# Altium schematic sheet P20 Hole.SchDoc
size 297 x 209 mm
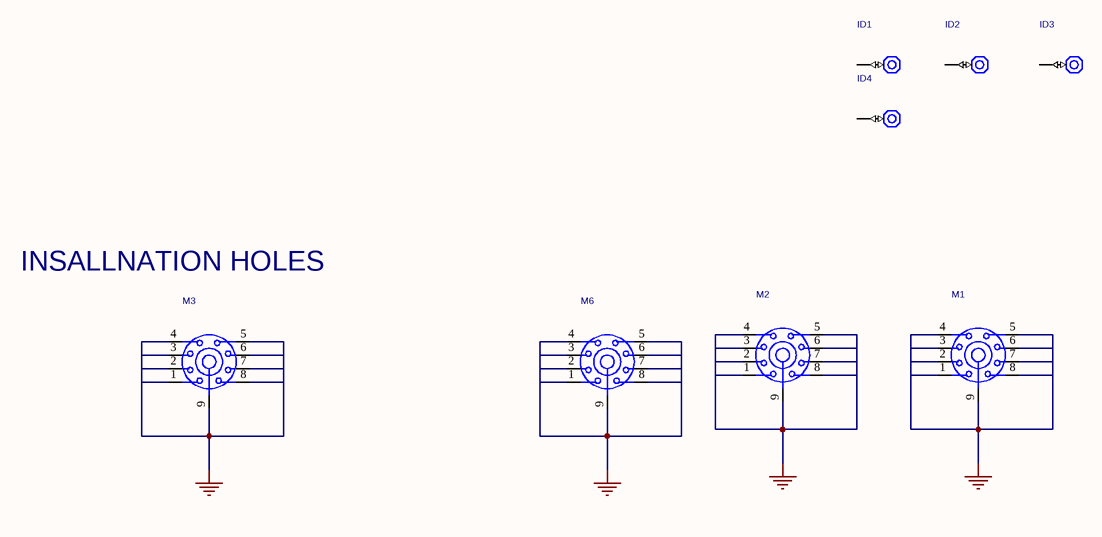
[diagram p0: P20 Hole.SchDoc]

## Parts
ID1  ID-BOARD  [ID-BOARD]  (value not drawn)
ID2  ID-BOARD  [ID-BOARD]  (value not drawn)
ID3  ID-BOARD  [ID-BOARD]  (value not drawn)
ID4  ID-BOARD  [ID-BOARD]  (value not drawn)
M1  HOLE-8STARS  [MTH_C6MMD3P2MM]  (value not drawn)
M2  HOLE-8STARS  [MTH_C6MMD3P2MM]  (value not drawn)
M3  HOLE-8STARS  [MTH_C6MMD3P2MM]  (value not drawn)
M6  HOLE-8STARS  [MTH_C6MMD3P2MM]  (value not drawn)

## Nets
GND: M1.1(GND0) M1.2(GND1) M1.3(GND2) M1.4(GND3) M1.5(GND4) M1.6(GND5) M1.7(GND6) M1.8(GND7) M1.9(HOLE) M2.1(GND0) M2.2(GND1) M2.3(GND2) M2.4(GND3) M2.5(GND4) M2.6(GND5) M2.7(GND6) M2.8(GND7) M2.9(HOLE) M3.1(GND0) M3.2(GND1) M3.3(GND2) M3.4(GND3) M3.5(GND4) M3.6(GND5) M3.7(GND6) M3.8(GND7) M3.9(HOLE) M6.1(GND0) M6.2(GND1) M6.3(GND2) M6.4(GND3) M6.5(GND4) M6.6(GND5) M6.7(GND6) M6.8(GND7) M6.9(HOLE)

Not connected (* = marked no-connect by the designer): ID1 1; ID2 1; ID3 1; ID4 1

## Notes on the sheet
- INSALLNATION HOLES

## Library data of the parts
ID1-ID4 = ID-BOARD: PARTS: 1; LEVEL: STD; OriginalSymbolOrigin: (0,0); DEVICE: ID-BOARD; PKG_TYPE: ID-BOARD
M1-M3 M6 = HOLE-8STARS: PARTS: 1; LEVEL: STD; OriginalSymbolOrigin: (0,0); DEVICE: HOLE-8STARS; PKG_TYPE: MTH_C6MMD3P2MM